# Altium schematic sheet SysPower.SchDoc
size 220 x 165 mm
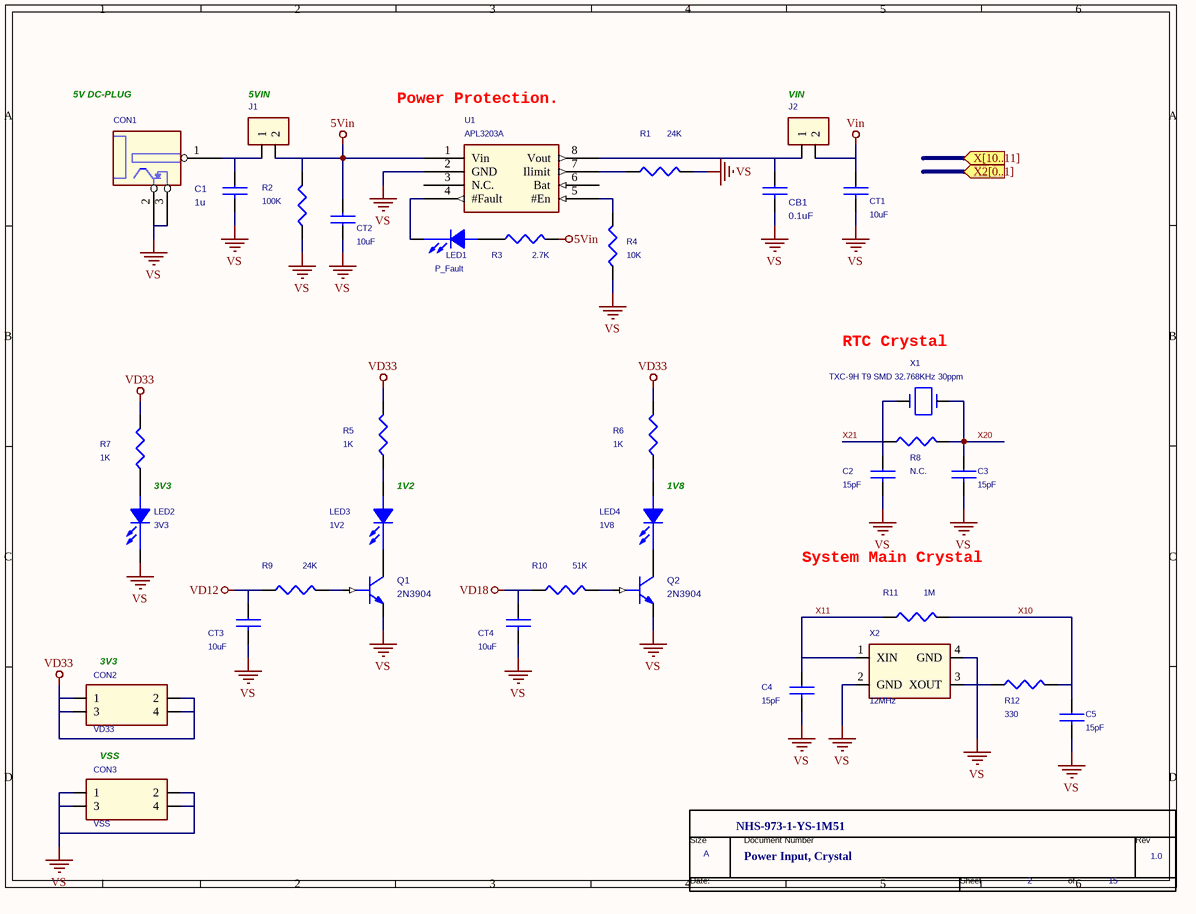
[diagram p0: SysPower.SchDoc]

## Parts
*  RevCode: 1.0  Page Size: A  Page Number: 2  Page Count: 15  Doc: Power Input, Crystal  OrgName: NHS-973-1-YS-1M51  (hidden comment: TitleBlock0N)  (graphical)
C1  1u  [C0603]
C2  15pF  [C0603]
C3  15pF  [C0603]
C4  15pF  [C0603]
C5  15pF  [C0603]
CB1  0.1uF  [C0603]
CON1  DC-PLUG  [3]  (value not drawn)
CON2  VD33  [Header_2x2_2.54mm]
CON3  VSS  [Header_2x2_2.54mm]
CT1  10uF  [C0603]
CT2  10uF  [C0603]
CT3  10uF  [C0603]
CT4  10uF  [C0603]
J1  5Vin  [Header_2x1_2.54mm]  (value not drawn)
J2  Vin  [Header_2x1_2.54mm]  (value not drawn)
LED1  P_Fault  [LED_0603]
LED2  3V3  [LED_0603]
LED3  1V2  [LED_0603]
LED4  1V8  [LED_0603]
Q1  2N3904  [SOT23-BEC]
Q2  2N3904  [SOT23-BEC]
R1  24K  [R0603]
R2  100K  [R0603]
R3  2.7K  [R0603]
R4  10K  [R0603]
R5  1K  [R0603]
R6  1K  [R0603]
R7  1K  [R0603]
R8  N.C.  [R0603]
R9  24K  [R0603]
R10  51K  [R0603]
R11  1M  [R0603]
R12  330  [R0603]
U1  APL3203A  [TDFN2x2-8]
X1  TXC-9H T9 SMD 32.768KHz 30ppm  [XTAL_2P/1.5mm]
X2  12MHz  [TXC7m-3.2x2.5mm]

## Ports
X2[0..1] (in), X[10..11] (in)

## Nets
5Vin: CT2.2 J1.2 R2.2 R3.2 U1.1(Vin)
VD12: CT3.1 R9.2
VD18: CT4.1 R10.2
VD33: CON2.1 CON2.2 CON2.3 CON2.4 R5.2 R6.2 R7.2
Vin: CT1.1 J2.2
VS: C1.2 C2.2 C3.2 C4.2 C5.2 CB1.2 CON1.2 CON1.3 CON3.1 CON3.2 CON3.3 CON3.4 CT1.2 CT2.1 CT3.2 CT4.2 LED2.2(CATHODE) Q1.E Q2.E R1.1 R2.1 R4.2 U1.2(GND) X2.2(GND) X2.4(GND)
X10: C5.1 R11.1 R12.2
X11: C4.1 R11.2 X2.1(XIN)
X20: C3.1 R8.1 X1.1
X21: C2.1 R8.2 X1.2
NetC1_1: C1.1 CON1.1 J1.1
NetCB1_1: CB1.1 J2.1 U1.8(Vout)
NetLED1_1: LED1.1(ANODE) R3.1
NetLED1_2: LED1.2(CATHODE) U1.4(#Fault)
NetLED2_1: LED2.1(ANODE) R7.1
NetLED3_1: LED3.1(ANODE) R5.1
NetLED3_2: LED3.2(CATHODE) Q1.C
NetLED4_1: LED4.1(ANODE) R6.1
NetLED4_2: LED4.2(CATHODE) Q2.C
NetQ1_B: Q1.B R9.1
NetQ2_B: Q2.B R10.1
NetR1_2: R1.2 U1.7(Ilimit)
NetR4_1: R4.1 U1.5(#En)
NetR12_1: R12.1 X2.3(XOUT)

Not connected (* = marked no-connect by the designer): U1 3(N.C.) 6(Bat)

## Notes on the sheet
- 5V DC-PLUG
- (near J1) 5VIN
- (near U1) Power Protection.
- (near J2) VIN
- (near X1) RTC Crystal
- 3V3
- (near LED3) 1V2
- (near LED4) 1V8
- System Main Crystal
- (near CON2) 3V3
- VSS
- (in symbol TitleBlock0N) Size; Document Number; Rev; Date:; Sheet; of

## Library data of the parts
C1-C5 CB1 CT1-CT4 = CAP NP
CON1 = Power Jack
CON2 CON3 = CON4A
J1 J2 = CON2
LED1-LED4 = LED
Q1 Q2 = NPN_1
R1-R12 = R
U1 = APL3203A_1
X1 = MA306/SM_2: Vendor: TXC
X2 = Crystal_SMD_2
* = TitleBlock0N: Page Create Date: April 25, 1995